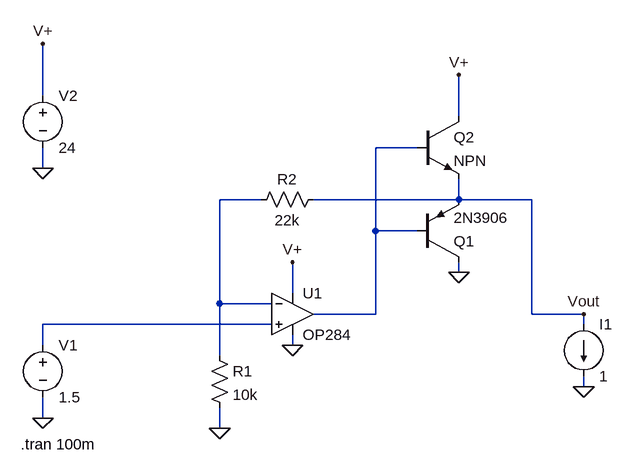
[diagram p0: schematic 0-10_Out.asc]
0-10_Out.asc, the LTspice schematic file:
Version 4
SHEET 1 880 680
WIRE -224 -176 -224 -256
WIRE 416 -144 416 -208
WIRE 352 -96 288 -96
WIRE -224 -64 -224 -96
WIRE 112 -16 48 -16
WIRE 416 -16 416 -48
WIRE 416 -16 192 -16
WIRE 528 -16 416 -16
WIRE 288 32 288 -96
WIRE 352 32 288 32
WIRE 416 96 416 80
WIRE 160 128 160 80
WIRE 48 144 48 -16
WIRE 128 144 48 144
WIRE 288 160 288 32
WIRE 288 160 192 160
WIRE 528 160 528 -16
WIRE 608 160 528 160
WIRE 128 176 -224 176
WIRE 608 176 608 160
WIRE -224 208 -224 176
WIRE 160 208 160 192
WIRE 48 224 48 144
WIRE 608 272 608 256
WIRE -224 320 -224 288
WIRE 48 336 48 304
FLAG 160 80 V+
FLAG 416 96 0
FLAG 160 208 0
FLAG 48 336 0
FLAG -224 -64 0
FLAG -224 320 0
FLAG -224 -256 V+
FLAG 608 272 0
FLAG 608 160 Vout
FLAG 416 -208 V+
SYMBOL Opamps\\OP284 160 96 R0
SYMATTR InstName U1
SYMBOL res 32 208 R0
SYMATTR InstName R1
SYMATTR Value 10k
SYMBOL res 208 -32 R90
WINDOW 0 0 56 VBottom 2
WINDOW 3 32 56 VTop 2
SYMATTR InstName R2
SYMATTR Value 22k
SYMBOL pnp 352 80 M180
SYMATTR InstName Q1
SYMATTR Value 2N3906
SYMBOL voltage -224 192 R0
SYMATTR InstName V1
SYMATTR Value 1.5
SYMBOL voltage -224 -192 R0
SYMATTR InstName V2
SYMATTR Value 24
SYMBOL current 608 176 R0
SYMATTR InstName I1
SYMATTR Value 1
SYMBOL npn 352 -144 R0
SYMATTR InstName Q2
TEXT -258 360 Left 2 !.tran 100m

The netlist it stands for:
* 0-10_Out.asc
XU1 N003 N002 V+ 0 N001 OP284  ; pins In+ In- V+ V- OUT
R1 N002 0 10k
R2 Vout N002 22k
Q1 0 N001 Vout 0 2N3906
V1 N003 0 1.5
V2 V+ 0 24
I1 Vout 0 1
Q2 V+ N001 Vout 0 NPN
.model NPN NPN
.model PNP PNP
.lib standard.bjt
.tran 100m
.lib ADI1.lib
.backanno
.end